# EAGLE schematic single2 (EAGLE 6.6.0)
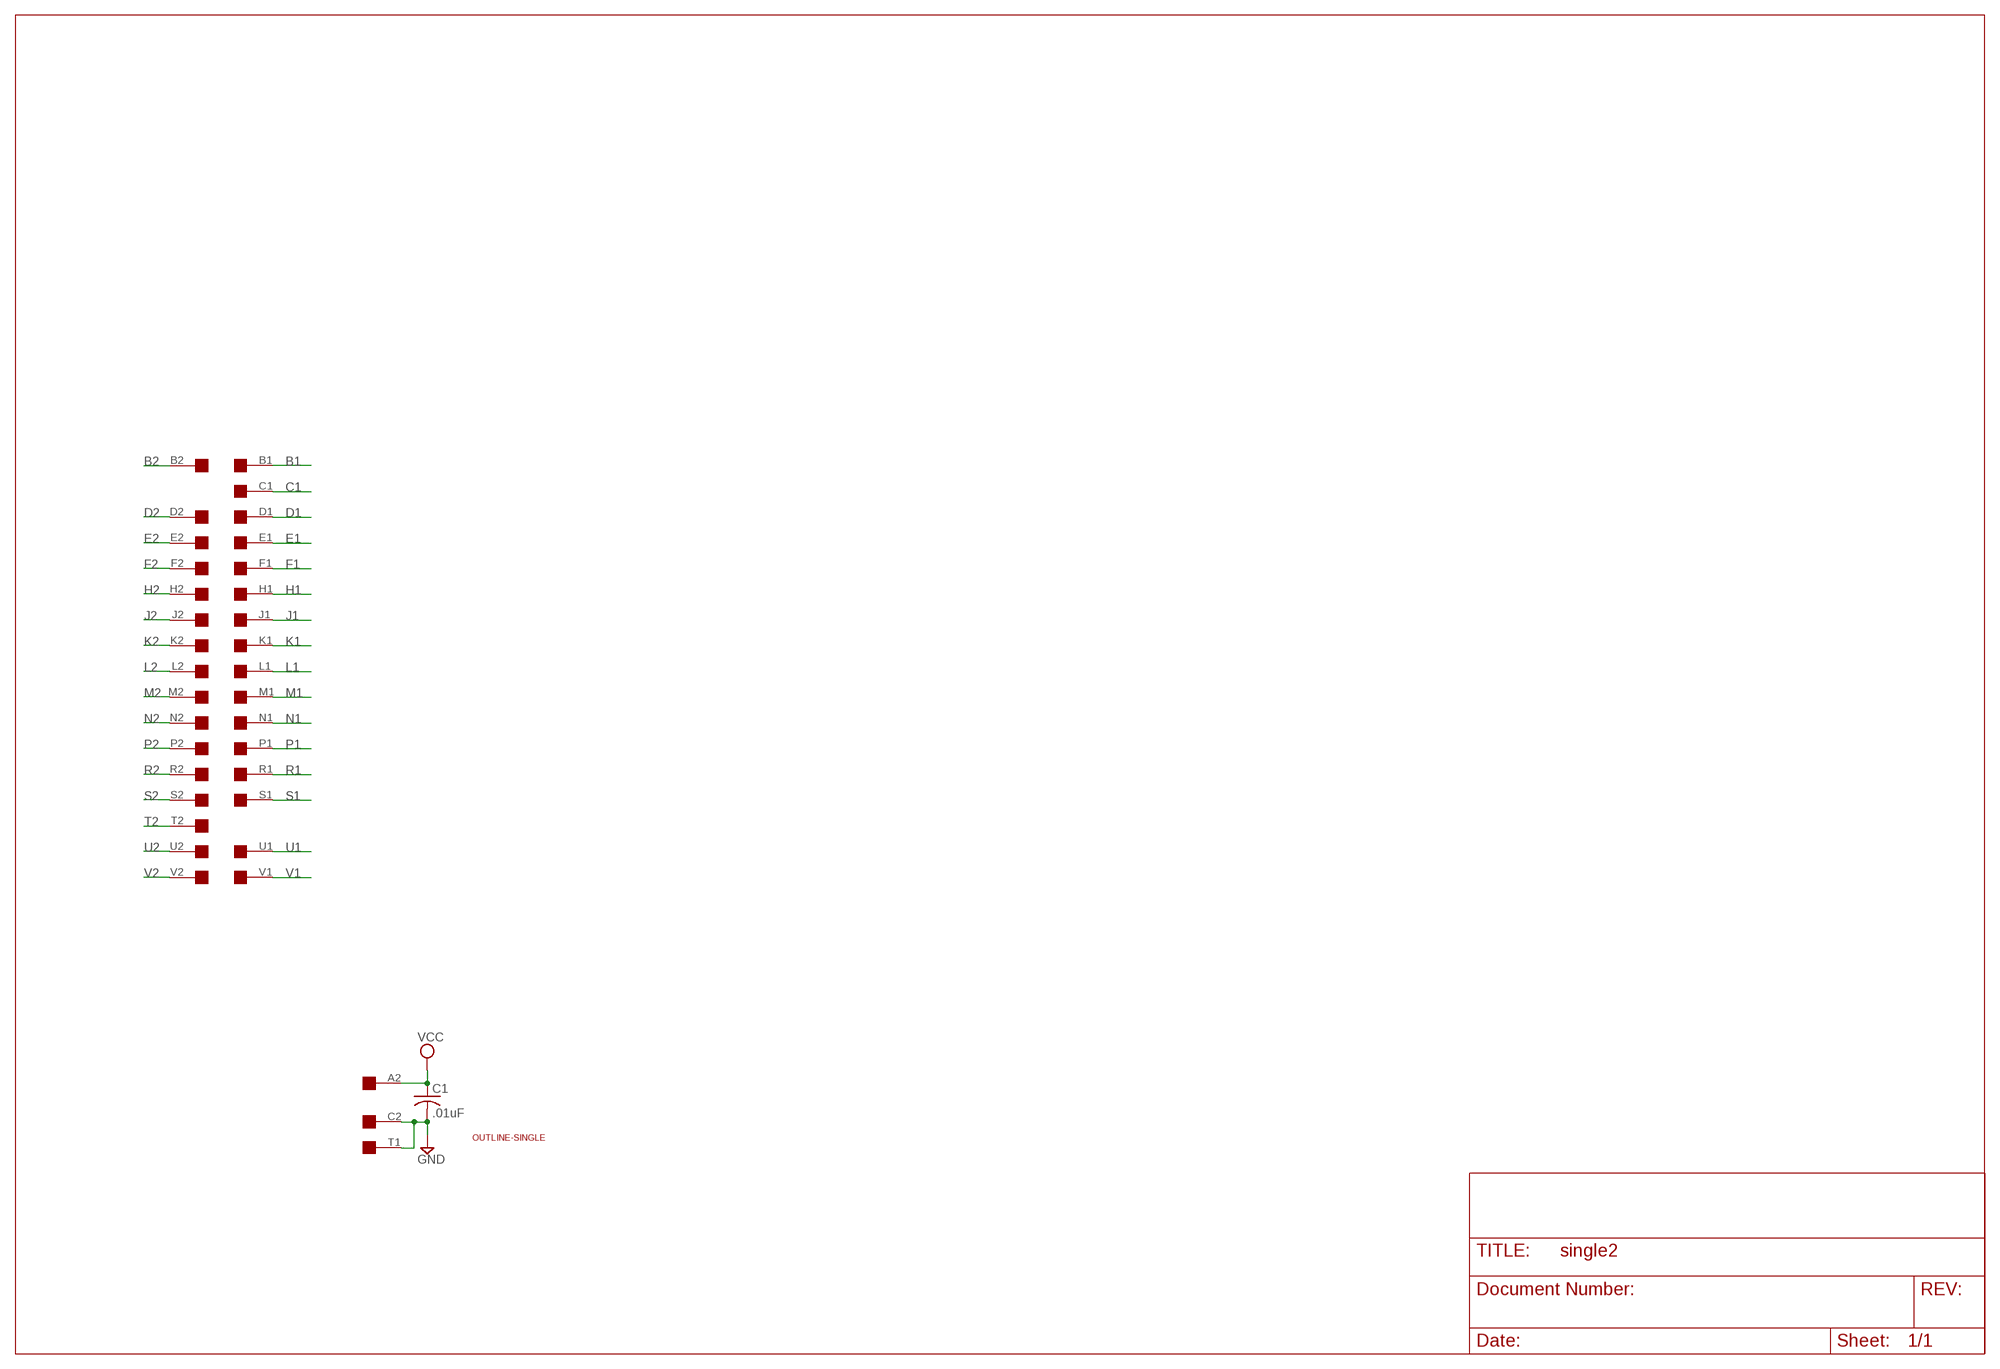
[diagram p0: schematic, sheet 1]

## Parts
C1  .01uF  C-US  [C063-025X075]
U$1  OUTLINE-SINGLE  [SINGLE]
U$2  SINGLE  [EDGE-CON2]

## Nets
B1: U$2.B1
B2: U$2.B2
C1: U$2.C1
D1: U$2.D1
D2: U$2.D2
E1: U$2.E1
E2: U$2.E2
F1: U$2.F1
F2: U$2.F2
GND: C1.2 U$2.C2 U$2.T1
H1: U$2.H1
H2: U$2.H2
J1: U$2.J1
J2: U$2.J2
K1: U$2.K1
K2: U$2.K2
L1: U$2.L1
L2: U$2.L2
M1: U$2.M1
M2: U$2.M2
N1: U$2.N1
N2: U$2.N2
P1: U$2.P1
P2: U$2.P2
R1: U$2.R1
R2: U$2.R2
S1: U$2.S1
S2: U$2.S2
T2: U$2.T2
U1: U$2.U1
U2: U$2.U2
V1: U$2.V1
V2: U$2.V2
VCC: C1.1 U$2.A2
Unconnected: U$2.A1

## Library data of the parts
C1 = dec-con:C-US: Capacitors with funky DEC lead spacing.
U$1 = dec-con:OUTLINE-*: Board outlines for DEC boards.
U$2 = dec-con:SINGLE: Single-Height DEC board